# EAGLE design power-motor (EAGLE 7.5.0)
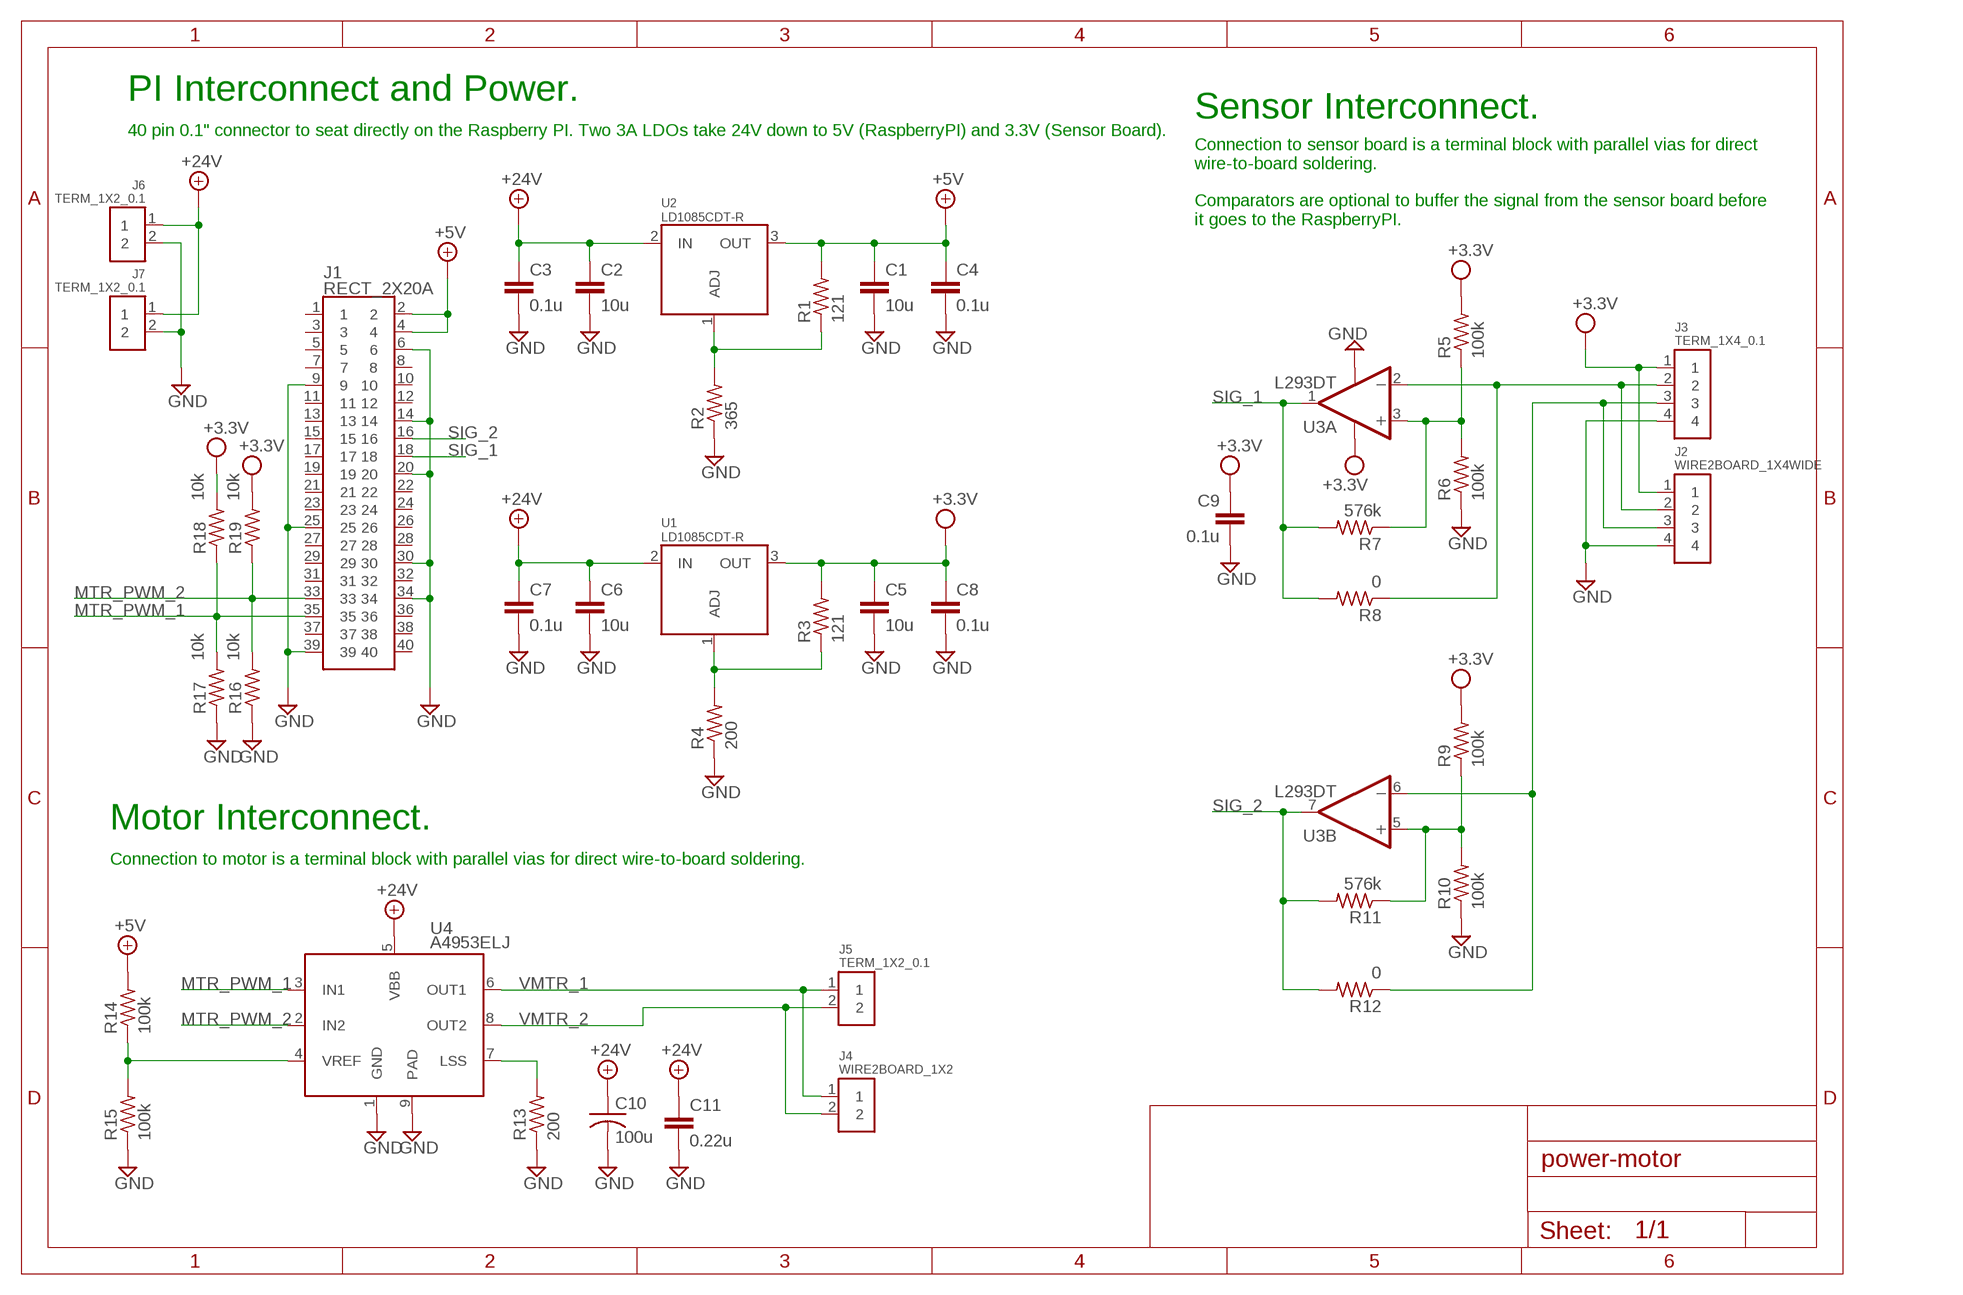
[diagram p0: schematic, sheet 1]

## Parts
C1  10u  C0805  [C0805]
C2  10u  C0805  [C0805]
C3  0.1u  C0805  [C0805]
C4  0.1u  C0805  [C0805]
C5  10u  C0805  [C0805]
C6  10u  C0805  [C0805]
C7  0.1u  C0805  [C0805]
C8  0.1u  C0805  [C0805]
C9  0.1u  C0805  [C0805]
C10  100u  C-POL8  [CPOL-8]
C11  0.22u  C0805  [C0805]
J1  RECT_2X20A  [RECT_2X20_0.1]
J2  WIRE2BOARD_1X4WIDE  [WIRE2BOARD_1X4W]
J3  TERM_1X4_0.1  [TERM_1X4_0.1]
J4  WIRE2BOARD_1X2  [WIRE2BOARD_1X2]
J5  TERM_1X2_0.1  [TERM_1X2_0.1]
J6  TERM_1X2_0.1  [TERM_1X2_0.1]
J7  TERM_1X2_0.1  [TERM_1X2_0.1]
R1  121  R0805  [R0805]
R2  365  R0805  [R0805]
R3  121  R0805  [R0805]
R4  200  R0805  [R0805]
R5  100k  R0805  [R0805]
R6  100k  R0805  [R0805]
R7  576k  R0805  [R0805]
R8  0  R0805  [R0805]
R9  100k  R0805  [R0805]
R10  100k  R0805  [R0805]
R11  576k  R0805  [R0805]
R12  0  R0805  [R0805]
R13  200  R2512  [R2512]
R14  100k  R0805  [R0805]
R15  100k  R0805  [R0805]
R16  10k  R0805  [R0805]
R17  10k  R0805  [R0805]
R18  10k  R0805  [R0805]
R19  10k  R0805  [R0805]
U1  LD1085CDT-R  [TO252]
U2  LD1085CDT-R  [TO252]
U3  L293DT  [SOIC8]
U4  A4953ELJ  [SOIC8]

## Nets
+5V: C1.1 C4.1 J1.2 J1.4 R1.2 R14.2 U2.3(OUT)
+24V: C2.1 C3.1 C6.1 C7.1 C10.P$1 C11.1 J6.1 J7.1 U1.2(IN) U2.2(IN) U4.5(VBB)
GND: C1.2 C2.2 C3.2 C4.2 C5.2 C6.2 C7.2 C8.2 C9.2 C10.P$2 C11.2 J1.6 J1.9 J1.14 J1.20 J1.25 J1.30 J1.34 J1.39 J2.4 J3.4 J6.2 J7.2 R2.1 R4.1 R6.1 R10.1 R13.1 R15.1 R16.1 R17.1 U3.4(A:V-) U4.1(GND) U4.9(PAD)
MTR_PWM_1: J1.35 R17.2 R18.1 U4.3(IN1)
MTR_PWM_2: J1.33 R16.2 R19.1 U4.2(IN2)
N$1: R5.1 R6.2 R7.1 U3.3(A:+IN)
N$2: R1.1 R2.2 U2.1(ADJ)
N$3: J2.2 J3.2 R8.1 U3.2(A:-IN)
N$4: J2.3 J3.3 R12.1 U3.6(B:-IN)
N$5: R3.1 R4.2 U1.1(ADJ)
N$6: R14.1 R15.2 U4.4(VREF)
N$7: R13.2 U4.7(LSS)
N$8: R9.1 R10.2 R11.1 U3.5(B:+IN)
SIG_1: J1.18 R7.2 R8.2 U3.1(A:OUT)
SIG_2: J1.16 R11.2 R12.2 U3.7(B:OUT)
VDD: C5.1 C8.1 C9.1 J2.1 J3.1 R3.2 R5.2 R9.2 R18.2 R19.2 U1.3(OUT) U3.8(A:V+) ; supply symbol labelled +3.3V
VMTR_1: J4.1 J5.1 U4.6(OUT1)
VMTR_2: J4.2 J5.2 U4.8(OUT2)
Unconnected: J1.1 J1.3 J1.5 J1.7 J1.8 J1.10 J1.11 J1.12 J1.13 J1.15 J1.17 J1.19 J1.21 J1.22 J1.23 J1.24 J1.26 J1.27 J1.28 J1.29 J1.31 J1.32 J1.36 J1.37 J1.38 J1.40

## Notes on the sheet
- PI Interconnect and Power.
- Sensor Interconnect.
- 40 pin 0.1" connector to seat directly on the Raspberry PI. Two 3A LDOs take 24V down to 5V (RaspberryPI) and 3.3V (Sensor Board).
- Connection to sensor board is a terminal block with parallel vias for direct 
  wire-to-board soldering. 
  
  Comparators are optional to buffer the signal from the sensor board before 
  it goes to the RaspberryPI.
- Motor Interconnect.
- Connection to motor is a terminal block with parallel vias for direct wire-to-board soldering.

## Library data of the parts
C1 C2 C5 C6 = dsantoro-discrete:C; DKPN: 490-5523-1-ND
C3 C4 C7-C9 = dsantoro-discrete:C; DKPN: 1276-6468-1-ND
C10 = dsantoro-discrete:C-POL; DKPN: 1189-1860-ND
C11 = dsantoro-discrete:C; DKPN: 1276-1093-1-ND
J1 = dsantoro-conn:RECT_2X20A; DKPN: S9200-ND
J2 = dsantoro-conn:WIRE2BOARD_1X4
J3 = dsantoro-conn:TERM_1X4_0.1; DKPN: ED10563-ND
J4 = dsantoro-conn:WIRE2BOARD_1X2
J5-J7 = dsantoro-conn:TERM_1X2_0.1; DKPN: ED10561-ND
R1 R3 = dsantoro-discrete:R; DKPN: 311-121CRCT-ND
R2 = dsantoro-discrete:R; DKPN: 311-365CRCT-ND
R4 = dsantoro-discrete:R; DKPN: 311-200ARCT-ND
R5 R6 R9 R10 R14 R15 = dsantoro-discrete:R; DKPN: 311-100KCRCT-ND
R7 R11 = dsantoro-discrete:R; DKPN: 311-576KCRCT-ND
R8 R12 = dsantoro-discrete:R; DKPN: 311-0.0ARCT-ND
R13 = dsantoro-discrete:R; DKPN: 541-200RCT-ND
R16-R19 = dsantoro-discrete:R; DKPN: 311-10.0KCRCT-ND
U1 U2 = dsantoro-pwr:LD1085CDT; DKPN: 497-3418-1-ND
U3 = dsantoro-op:L293; DKPN: 497-8079-1-ND
U4 = dsantoro-misc:A4953E; DKPN: 620-1428-1-ND

## Board
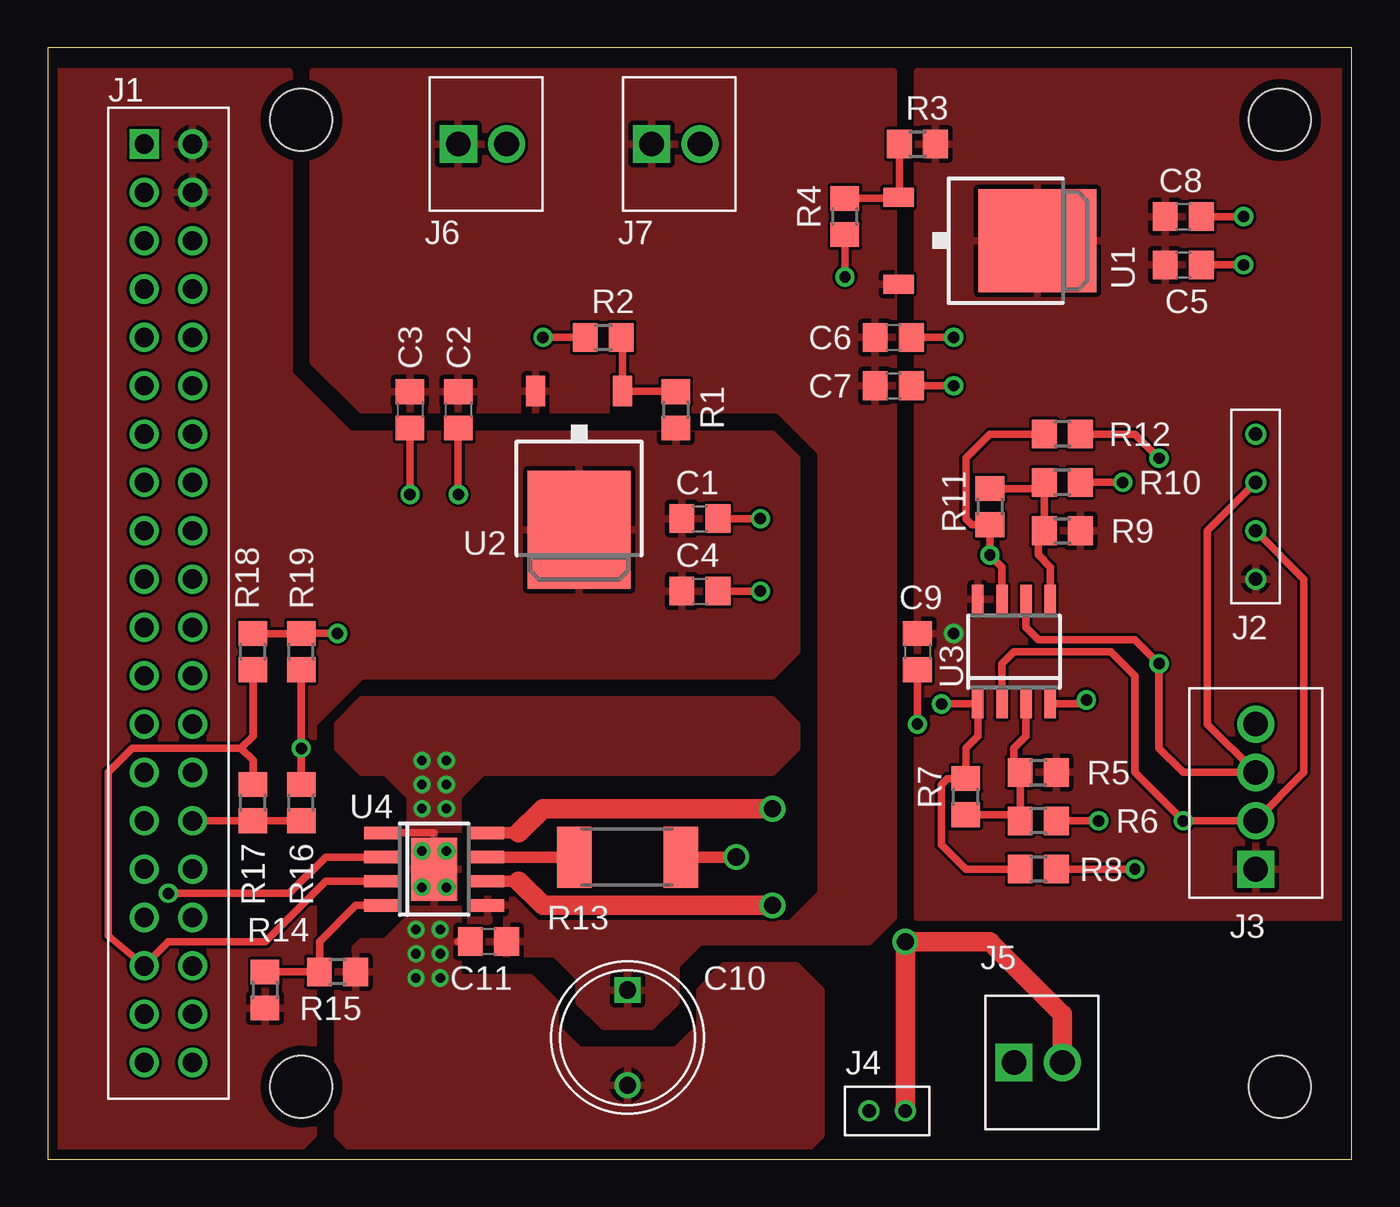
[diagram p1: board, top side]
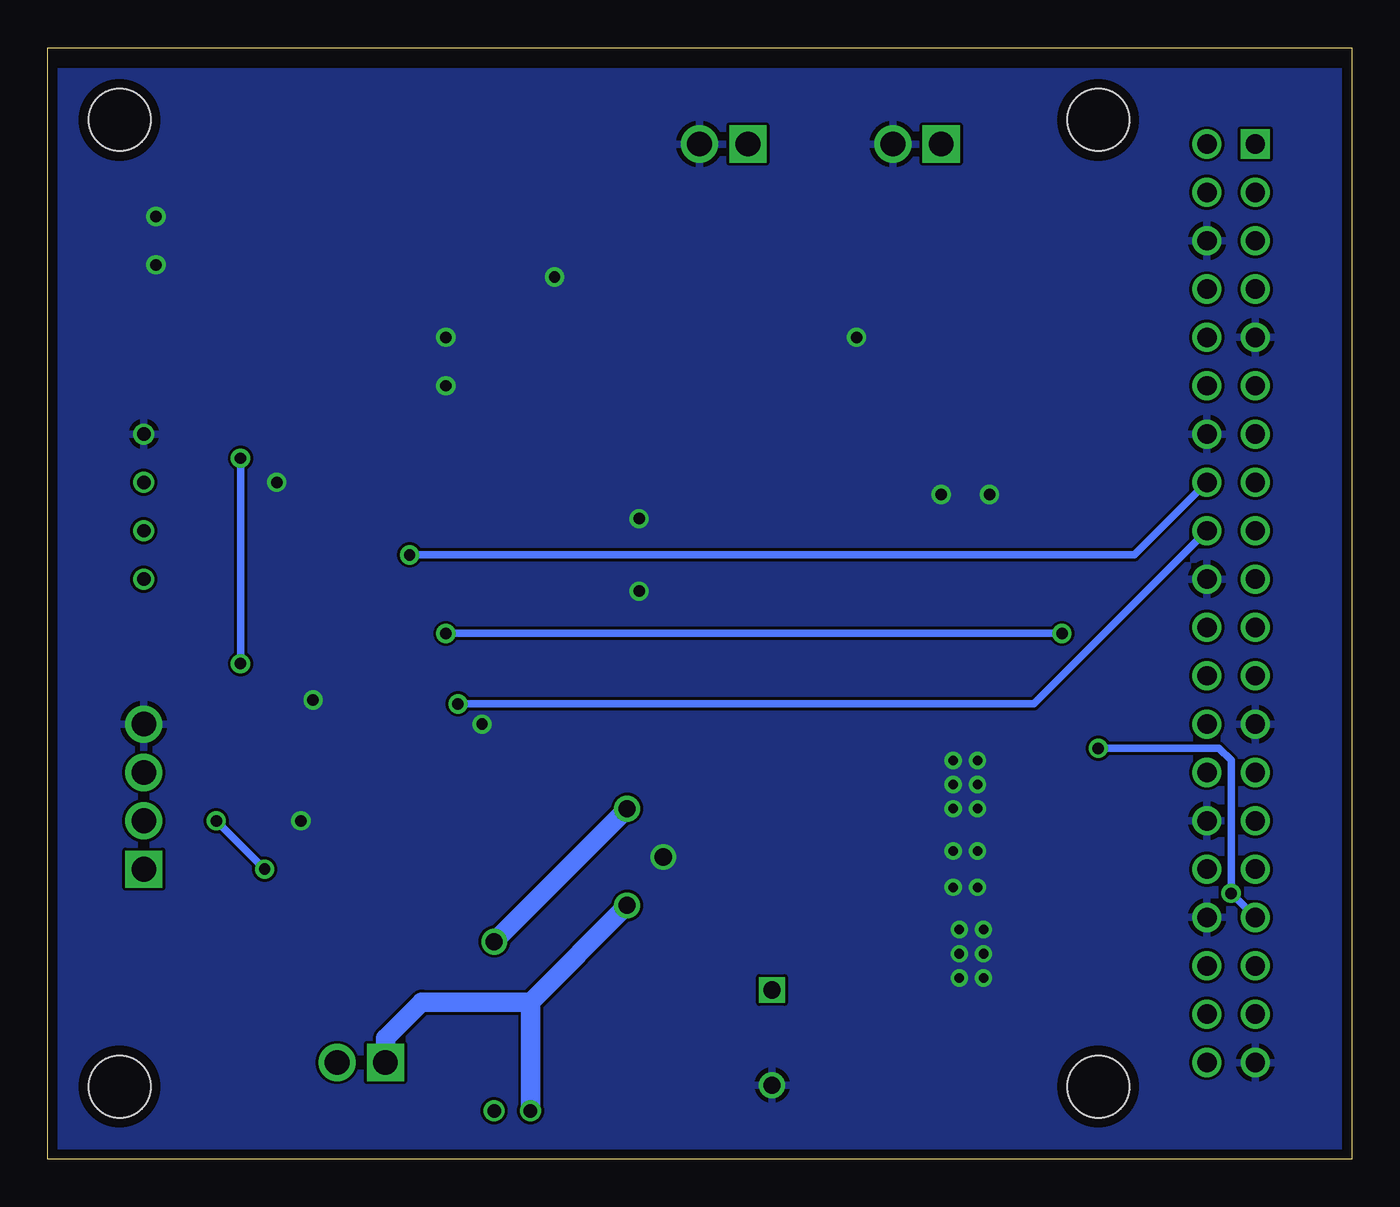
[diagram p2: board, bottom side, seen from below]

Size 68.56 x 58.41 mm. Coordinates in mm from the lower left corner, seen from the top.
Outline: 0,0 68.56,0 68.56,58.41 0,58.41 0,0
Copper layers (1*16): Top 0.0178mm / dielectric 59mil / Bottom 0.0178mm
Design rules "SSC-EAGLE-2Lyr_v1.0.0.3": minimum track width 6mil, minimum drill 14mil, track to track 6mil, track to pad 6mil, pad to pad 6mil, via to via 6mil, smd to smd 6mil, copper to edge 20mil, drill to drill 16mil, minimum pad ring 8mil, minimum via ring 8mil, stop-mask expansion 3mil, vias tented up to drill 0mil, thermal gap 10mil
Holes 3.26 mm at 64.77,54.61 64.77,3.81 13.34,54.61 13.34,3.81

### Footprints (pad centres in the part's own frame; a part is rotated, then mirrored left to right if it is on the bottom)
C0805 = smd 1.3 x 1.5: 1 -0.95,0; 2 0.95,0
CPOL-8 = drill 0.9 square: P$1 0,0 | drill 0.9: P$2 0,-5
RECT_2X20_0.1 = drill 1.02 square: 1 0,0 | drill 1.02: 2 2.54,0; 3 0,-2.54; 4 2.54,-2.54; 5 0,-5.08; 6 2.54,-5.08; 7 0,-7.62; 8 2.54,-7.62; 9 0,-10.16; 10 2.54,-10.16; 11 0,-12.7; 12 2.54,-12.7; 13 0,-15.24; 14 2.54,-15.24; 15 0,-17.78; 16 2.54,-17.78; 17 0,-20.32; 18 2.54,-20.32; 19 0,-22.86; 20 2.54,-22.86; 21 0,-25.4; 22 2.54,-25.4; 23 0,-27.94; 24 2.54,-27.94; 25 0,-30.48; 26 2.54,-30.48; 27 0,-33.02; 28 2.54,-33.02; 29 0,-35.56; 30 2.54,-35.56; 31 0,-38.1; 32 2.54,-38.1; 33 0,-40.64; 34 2.54,-40.64; 35 0,-43.18; 36 2.54,-43.18; 37 0,-45.72; 38 2.54,-45.72; 39 0,-48.26; 40 2.54,-48.26
WIRE2BOARD_1X4W = drill 0.7: 1 0,0; 2 0,-2.54; 3 0,-5.08; 4 0,-7.62
TERM_1X4_0.1 = drill 1.3 square: 1 0,0 | drill 1.3: 2 0,-2.54; 3 0,-5.08; 4 0,-7.62
WIRE2BOARD_1X2 = drill 0.7: 1 0,0; 2 0,-1.905
TERM_1X2_0.1 = drill 1.3 square: 1 0,0 | drill 1.3: 2 0,-2.54
R0805 = smd 1.3 x 1.5: 1 -0.95,0; 2 0.95,0
R2512 = smd 1.8 x 3.2: 1 -2.8,0; 2 2.8,0
TO252 = smd 1 x 1.6: 1 -2.28,-4.8; 2 2.28,-4.8 | smd 5.4 x 6.2: 3 0,2.5
SOIC8 = smd 0.6 x 1.5: 1 -1.905,-2.75; 2 -0.635,-2.75; 3 0.635,-2.75; 4 1.905,-2.75; 5 1.905,2.75; 6 0.635,2.75; 7 -0.635,2.75; 8 -1.905,2.75
SOIC8' = smd 0.65 x 1.75: 1 -1.905,-2.8; 2 -0.635,-2.8; 3 0.635,-2.8; 4 1.905,-2.8; 5 1.905,2.8; 6 0.635,2.8; 7 -0.635,2.8; 8 -1.905,2.8 | smd 3.3 x 2.41: 9 0,0

### Placement (x,y rotation side)
C1  34.29,33.66 0 top
C2  21.59,39.37 270 top
C3  19.05,39.37 270 top
C4  34.29,29.84 0 top
C5  59.69,46.99 0 top
C6  44.45,43.18 0 top
C7  44.45,40.64 0 top
C8  59.69,49.53 0 top
C9  45.72,26.67 270 top
C10  30.48,8.89 0 top
C11  23.18,11.43 180 top
J1  5.08,53.34 0 top
J2  63.5,30.48 180 top
J3  63.5,15.24 180 top
J4  43.18,2.54 90 top
J5  50.8,5.08 90 top
J6  21.59,53.34 90 top
J7  31.75,53.34 90 top
R1  33.02,39.37 270 top
R2  29.21,43.18 0 top
R3  45.72,53.34 0 top
R4  41.91,49.53 90 top
R5  52.07,20.32 0 top
R6  52.07,17.78 180 top
R7  48.26,19.05 90 top
R8  52.07,15.24 180 top
R9  53.34,33.02 0 top
R10  53.34,35.56 180 top
R11  49.53,34.29 270 top
R12  53.34,38.1 180 top
R13  30.48,15.88 180 top
R14  11.43,8.89 270 top
R15  15.24,9.84 180 top
R16  13.34,18.73 90 top
R17  10.79,18.73 90 top
R18  10.79,26.67 90 top
R19  13.34,26.67 90 top
U1  49.53,48.26 270 top
U2  27.94,35.56 180 top
U3  50.8,26.67 0 top
U4  A4953ELJ  [SOIC8']  20.32,15.24 270 top

### Tracks (layer width: path | path; a pad name or v marks a point on that pad's centre or on a via)
+5V
  pour Top: 12.7,57.15 12.7,41.27 15.88,38.1 38.1,38.1 39.37,36.83 39.37,26.67 38.1,25.4 16.51,25.4 13.97,22.86 13.97,1.27 12.7,0 0,0 0,57.15
+24V
  pour Top: 44.45,57.15 13.97,57.15 13.97,41.91 16.51,39.37 38.42,39.37 40.64,37.15 40.64,13.97 39.05,12.38 25.72,12.38 24.45,13.65 22.23,13.65 22.23,10.79 26.67,10.79 27.94,9.53 27.94,8.26 29.21,6.99 31.75,6.99 33.02,8.26 33.02,10.16 34.29,11.43 43.18,11.43 44.45,12.7
GND  (via drill 0.5, 0.6, 0.9)
  Top 0.406: v47.62,40.64 C7.2 | v41.91,46.35 R4.1 | v47.62,43.18 C6.2 | v62.87,46.99 C5.2 | C8.2 v62.87,49.53 | v19.05,34.92 C3.2 | v21.59,34.92 C2.2 | v26.04,43.18 R2.1 | v37.47,33.66 C1.2 | v37.47,29.84 C4.2 | v45.72,22.86 C9.2 | v55.24,17.78 R6.1 | v54.61,24.13 54.4,23.92 U3.4 | R10.1 v56.52,35.56 | U4.1 20.32,17.14 | C11.2 21.59,11.43 | J1.30 R17.1 R16.1
  Top 0.61: v36.2,15.88 R13.1
  other vias: 19.68,16.19 20.95,16.19 20.95,14.29 19.68,14.29 20.95,18.41 20.64,12.06 19.68,18.41 20.95,19.68 20.95,20.95 19.68,20.95 19.68,19.68 19.37,12.06 20.64,10.79 20.64,9.53 19.37,10.79 19.37,9.53
  pour Bottom: 0,57.15 68.58,57.15 68.58,0 0,0
  pour Top: 15.24,22.86 15.24,21.59 16.51,20.32 17.78,20.32 19.05,19.05 19.05,12.7 17.78,11.43 16.51,11.43 15.24,10.16 15.24,1.27 16.51,0 39.37,0 40.64,1.27 40.64,8.89 39.37,10.16 35.56,10.16 34.29,8.89 34.29,6.99 33.02,5.71 27.94,5.71 26.67,6.99 26.67,8.26 25.4,9.53 21.59,9.53 21.59,19.05 22.86,20.32 38.1,20.32 39.37,21.59 39.37,22.86 38.1,24.13 16.51,24.13
MTR_PWM_1
  Top 0.406: U4.3 14.61,14.61 11.43,11.43 6.35,11.43 J1.35 3.17,11.75 3.17,20.32 4.45,21.59 10.16,21.59 | 10.16,21.59 10.79,20.95 R17.2 | 10.16,21.59 10.79,22.23 R18.1
MTR_PWM_2  (via drill 0.6)
  Top 0.406: v6.35,13.97 12.7,13.97 14.61,15.88 U4.2 | R16.2 v13.34,21.59 R19.1
  Bottom 0.406: J1.33 v6.35,13.97 6.35,20.95 6.99,21.59 v13.34,21.59
N$1
  Top 0.406: R7.1 50.8,18.1 R6.2 R5.1 50.8,20.64 50.8,21.59 51.44,22.23 U3.3
N$2
  Top 0.406: R2.2 30.22,43.12 U2.1 32.98,40.36 R1.1
N$3  (via drill 0.6)
  Top 0.406: U3.2 50.16,26.04 50.8,26.67 55.88,26.67 57.15,25.4 57.15,20.32 v59.69,17.78 J3.2 66.04,20.32 66.04,30.48 J2.2 | R8.1 v57.15,15.24
  Bottom 0.406: v57.15,15.24 v59.69,17.78
N$4  (via drill 0.6)
  Top 0.406: U3.6 51.44,27.94 52.07,27.3 57.15,27.3 v58.42,26.04 58.42,21.59 59.69,20.32 J3.3 60.96,22.86 60.96,33.02 J2.3 | R12.1 57.15,38.1 v58.42,36.83
  Bottom 0.406: v58.42,36.83 v58.42,26.04
N$5
  Top 0.406: R4.2 44.67,50.48 U1.1 44.77,50.58 R3.1
N$6
  Top 0.406: R14.1 R15.2 14.29,11.43 16.19,13.34 U4.4
N$7
  Top 0.61: U4.7 R13.2
N$8
  Top 0.406: U3.5 52.7,31.11 52.07,31.75 52.07,32.7 R9.1 R10.2 52.07,35.24 R11.1
SIG_1  (via drill 0.6)
  Top 0.406: U3.1 48.9,22.23 48.26,21.59 R7.2 47.3,20 46.99,19.68 46.99,16.51 48.26,15.24 R8.2 | v46.99,23.92 U3.1 | U3.1 48.9,24.13
  Bottom 0.406: J1.18 16.72,23.92 v46.99,23.92
SIG_2  (via drill 0.6)
  Top 0.406: U3.7 50.16,31.11 v49.53,31.75 R11.2 48.58,33.34 48.26,33.66 48.26,36.83 49.53,38.1 R12.2
  Bottom 0.406: J1.16 11.43,31.75 v49.53,31.75
VDD  (via drill 0.6)
  Top 0.406: R18.2 R19.2 v15.24,27.62
  Bottom 0.406: v15.24,27.62 v47.62,27.62
  pour Top: 45.72,57.15 45.72,12.7 68.58,12.7 68.58,57.15
VMTR_1  (via drill 0.9)
  Top 0.61: U4.6 24.77,14.61
  Top 1.016: 24.77,14.61 26.04,13.34 v38.1,13.34
  Bottom 1.016: v38.1,13.34 43.18,8.26 | 43.18,8.26 J4.1 | J5.1 50.8,6.35 48.9,8.26 43.18,8.26
VMTR_2  (via drill 0.9)
  Top 0.61: U4.8 24.77,17.14
  Top 1.016: 24.77,17.14 26.04,18.41 v38.1,18.41 | J4.2 v45.09,11.43 49.53,11.43 53.34,7.62 J5.2
  Bottom 1.016: v38.1,18.41 v45.09,11.43

### Text on the board
tDocu: 0x10933901 | Velocity Robotics. | 620C. | MOTOR CONTROL / SENSOR POWER. / REV. 0.